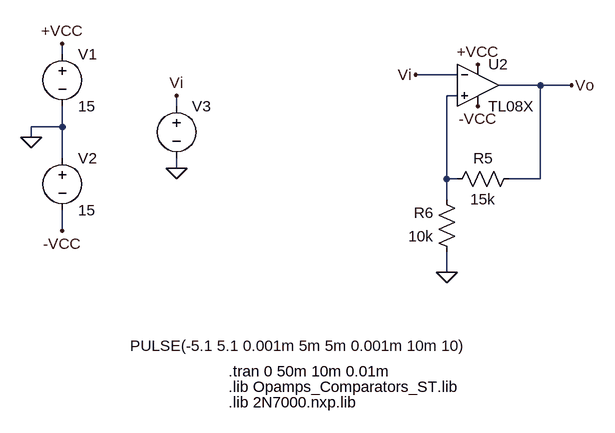
[diagram p0: schematic SchmittTrigger.asc]
SchmittTrigger.asc, the LTspice schematic file:
Version 4
SHEET 1 1172 680
WIRE -496 -144 -496 -160
WIRE 112 -112 48 -112
WIRE 240 -96 176 -96
WIRE 288 -96 240 -96
WIRE 112 -80 96 -80
WIRE -320 -64 -320 -80
WIRE -496 -32 -496 -64
WIRE -496 -32 -544 -32
WIRE -544 -16 -544 -32
WIRE -496 16 -496 -32
WIRE -320 32 -320 16
WIRE 96 48 96 -80
WIRE 112 48 96 48
WIRE 240 48 240 -96
WIRE 240 48 192 48
WIRE 96 80 96 48
WIRE -496 128 -496 96
WIRE 96 192 96 160
FLAG -544 -16 0
FLAG -496 -160 +VCC
FLAG -496 128 -VCC
FLAG 144 -64 -VCC
FLAG 144 -128 +VCC
FLAG -320 32 0
FLAG -320 -80 Vi
FLAG 96 192 0
FLAG 48 -112 Vi
FLAG 288 -96 Vo
SYMBOL voltage -496 -160 R0
WINDOW 123 0 0 Left 0
WINDOW 39 0 0 Left 0
SYMATTR InstName V1
SYMATTR Value 15
SYMBOL voltage -496 0 R0
WINDOW 123 0 0 Left 0
WINDOW 39 0 0 Left 0
SYMATTR InstName V2
SYMATTR Value 15
SYMBOL Opamps\\opamp2 144 -160 R0
SYMATTR InstName U2
SYMATTR Value TL08X
SYMBOL res 208 32 R90
WINDOW 0 0 56 VBottom 2
WINDOW 3 32 56 VTop 2
SYMATTR InstName R5
SYMATTR Value 15k
SYMBOL res 112 176 R180
WINDOW 0 36 76 Left 2
WINDOW 3 36 40 Left 2
SYMATTR InstName R6
SYMATTR Value 10k
SYMBOL voltage -320 -80 R0
WINDOW 123 0 0 Left 0
WINDOW 39 0 0 Left 0
WINDOW 3 -72 385 Left 2
SYMATTR InstName V3
SYMATTR Value PULSE(-5.1 5.1 0.001m 5m 5m 0.001m 10m 10)
TEXT -240 344 Left 2 !.tran 0 50m 10m 0.01m
TEXT -240 368 Left 2 !.lib Opamps_Comparators_ST.lib
TEXT -240 392 Left 2 !.lib 2N7000.nxp.lib

The netlist it stands for:
* SchmittTrigger.asc
V1 +VCC 0 15
V2 0 -VCC 15
XU2 N001 Vi +VCC -VCC Vo TL08X  ; pins In+ In- V+ V- OUT
R5 Vo N001 15k
R6 0 N001 10k
V3 Vi 0 PULSE(-5.1 5.1 0.001m 5m 5m 0.001m 10m 10)
.tran 0 50m 10m 0.01m
.lib Opamps_Comparators_ST.lib
.lib 2N7000.nxp.lib
.backanno
.end